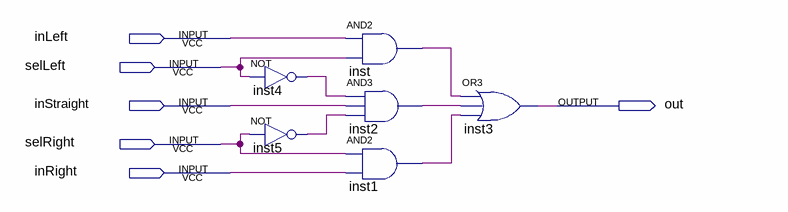
[diagram p0: schematic sheet]
// Quartus schematic userGridCell.bdf as structural Verilog: 6 symbols, 6 pins
module userGridCell (
  input  inLeft,
  input  selLeft,
  input  inStraight,
  input  selRight,
  input  inRight,
  output out
);

  wire inst1_out, inst2_out, inst4_out, inst5_out, inst_out;

  not inst4 (inst4_out, selLeft);
  not inst5 (inst5_out, selRight);
  and inst (inst_out, inLeft, selLeft);
  and inst2 (inst2_out, inst4_out, inStraight, inst5_out);
  and inst1 (inst1_out, selRight, inRight);
  or inst3 (out, inst_out, inst2_out, inst1_out);
endmodule
